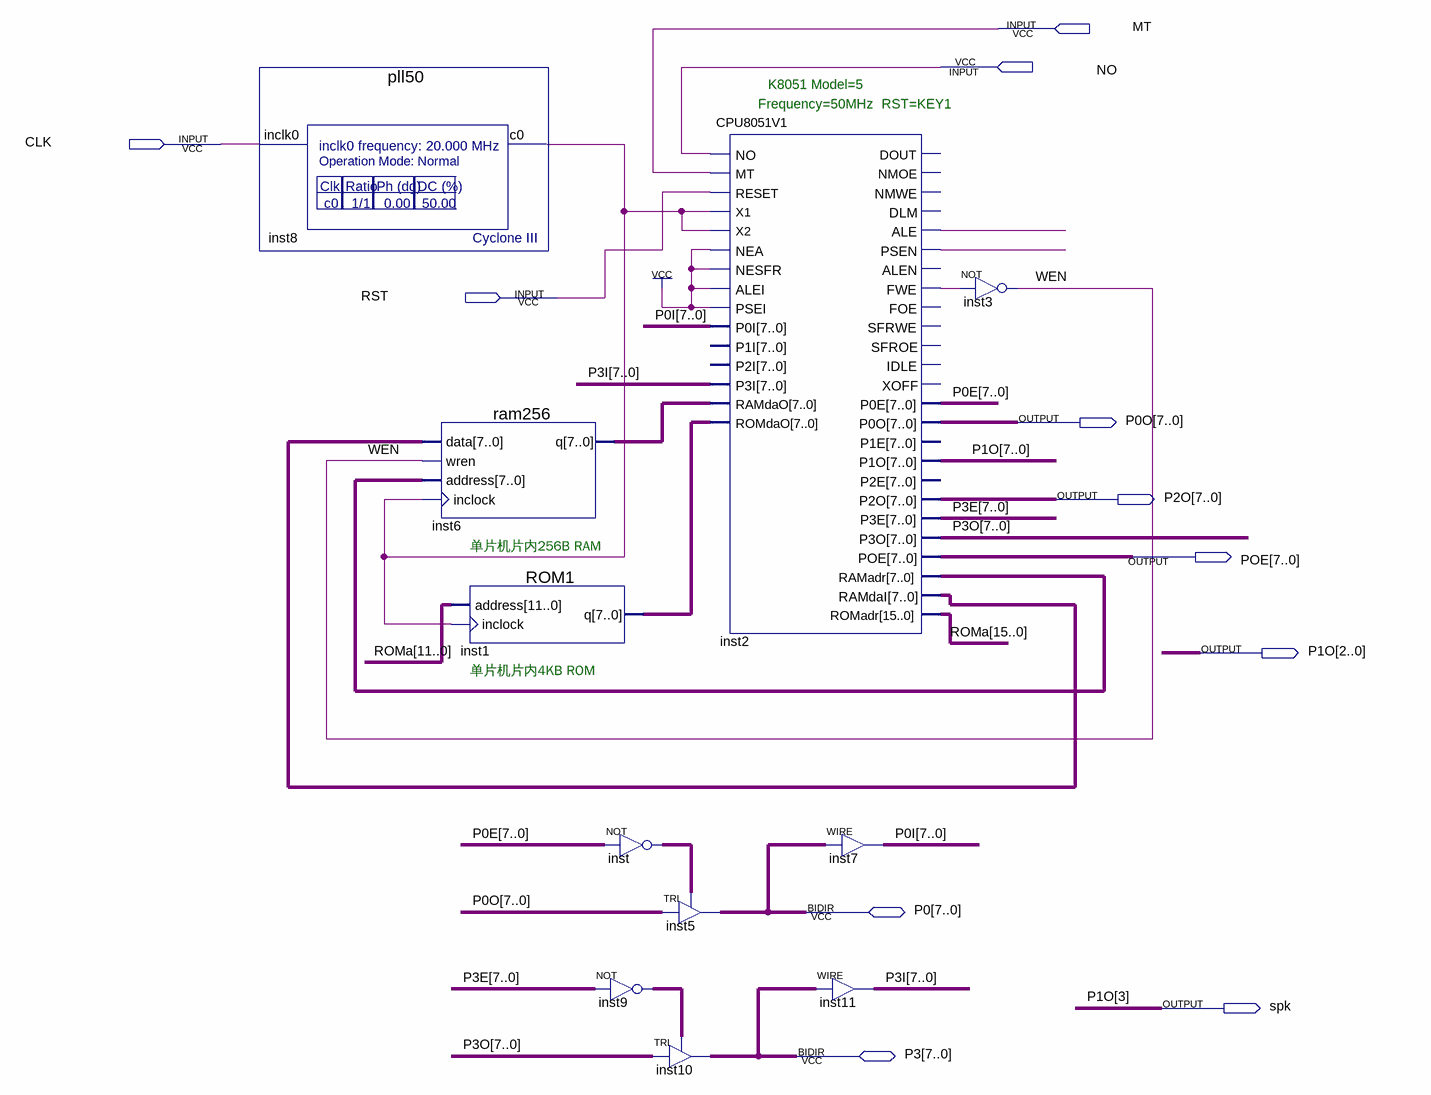
[diagram p0: schematic sheet]
// Quartus schematic MCU8951.bdf as structural Verilog: 11 symbols, 11 pins
module MCU8951 (
  input  MT,
  input  NO,
  input  CLK,
  input  RST,
  inout  [7:0] P0,
  inout  [7:0] P3,
  output [7:0] P0O,
  output [7:0] P2O,
  output [7:0] POE,
  output [7:0] P1O,
  output spk
);

  wire inst2_ale, inst2_fwe, inst2_psen, inst8_c0, WEN;
  wire [7:0] inst1_q, inst2_ramadr, inst2_ramdai, inst6_q, inst9_out, inst_out, P0E, P0I, P3E, P3I, P3O;
  wire [15:0] ROMa;

  pll50 inst8 (.inclk0(CLK), .c0(inst8_c0));
  ram256 inst6 (.data(inst2_ramdai), .wren(WEN), .address(inst2_ramadr), .inclock(inst8_c0), .q(inst6_q));
  ROM1 inst1 (.address(ROMa[11:0]), .inclock(inst8_c0), .q(inst1_q));
  assign inst_out = ~P0E;  // NOT inst, 8 bits wide
  assign inst9_out = ~P3E;  // NOT inst9, 8 bits wide
  TRI inst5[7:0] (.IN(P0O), .OE(inst_out), .OUT(P0));
  TRI inst10[7:0] (.IN(P3O), .OE(inst9_out), .OUT(P3));
  CPU8051V1 inst2 (
    .NO(NO), .MT(MT), .RESET(RST), .X1(inst8_c0), .X2(inst8_c0), .NEA(1'b1), .NESFR(1'b1), .ALEI(1'b1),
    .PSEI(1'b1), .P0I(P0I), .P3I(P3I), .RAMdaO(inst6_q), .ROMdaO(inst1_q), .ALE(inst2_ale),
    .PSEN(inst2_psen), .FWE(inst2_fwe), .P0E(P0E), .P0O(P0O), .P1O({P1O[7:4], spk, P1O[2:0]}), .P2O(P2O),
    .P3E(P3E), .P3O(P3O), .POE(POE), .RAMadr(inst2_ramadr), .RAMdaI(inst2_ramdai), .ROMadr(ROMa));  // open: P1I, P2I, DOUT, NMOE, NMWE, DLM, ALEN, FOE, SFRWE, SFROE, IDLE, XOFF, P1E, P2E
  assign P0I = P0;  // WIRE inst7
  assign P3I = P3;  // WIRE inst11
  not inst3 (WEN, inst2_fwe);

  // Other names for the same wires on the sheet: P1O[3] = spk

  // Notes on the sheet:
  //   K8051 Model=5   
  //   Frequency=50MHz  RST=KEY1    
  //   单片机片内256B RAM
  //   单片机片内4KB ROM
endmodule
